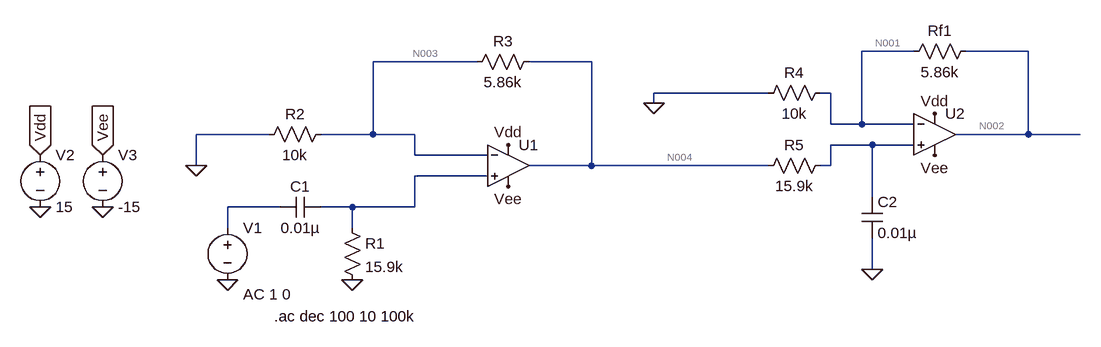
[diagram p0: schematic Active bandpass.asc]
Active bandpass.asc, the LTspice schematic file:
Version 4
SHEET 1 1520 680
WIRE 1024 224 944 224
WIRE 1200 224 1104 224
WIRE 352 240 192 240
WIRE 528 240 432 240
WIRE 800 288 624 288
WIRE 896 288 880 288
WIRE 624 304 624 288
WIRE 896 336 896 288
WIRE 944 336 944 224
WIRE 944 336 896 336
WIRE 1024 336 944 336
WIRE 32 352 -80 352
WIRE 192 352 192 240
WIRE 192 352 112 352
WIRE 256 352 192 352
WIRE 1200 352 1200 224
WIRE 1200 352 1088 352
WIRE 1280 352 1200 352
WIRE 960 368 896 368
WIRE 1024 368 960 368
WIRE 256 384 256 352
WIRE 368 384 256 384
WIRE -80 400 -80 352
WIRE 528 400 528 240
WIRE 528 400 432 400
WIRE 800 400 528 400
WIRE 896 400 896 368
WIRE 896 400 880 400
WIRE 368 416 256 416
WIRE 960 448 960 368
WIRE 48 464 -32 464
WIRE 160 464 112 464
WIRE 256 464 256 416
WIRE 256 464 160 464
WIRE -32 496 -32 464
WIRE 160 496 160 464
WIRE 960 560 960 512
FLAG -32 576 0
FLAG 160 576 0
FLAG -80 400 0
FLAG -320 384 Vdd
IOPIN -320 384 In
FLAG -224 384 Vee
IOPIN -224 384 In
FLAG -320 464 0
FLAG -224 464 0
FLAG 400 368 Vdd
FLAG 400 432 Vee
FLAG 1056 320 Vdd
FLAG 1056 384 Vee
FLAG 960 560 0
FLAG 624 304 0
SYMBOL Voltage -32 480 R0
WINDOW 123 24 118 Left 2
SYMATTR Value2 AC 1 0
SYMATTR InstName V1
SYMATTR Value ""
SYMBOL Voltage -320 368 R0
SYMATTR InstName V2
SYMATTR Value 15
SYMBOL Voltage -224 368 R0
SYMATTR InstName V3
SYMATTR Value -15
SYMBOL Res 144 480 R0
SYMATTR InstName R1
SYMATTR Value 15.9k
SYMBOL Cap 112 448 R90
WINDOW 0 0 32 VBottom 2
WINDOW 3 32 32 VTop 2
SYMATTR InstName C1
SYMATTR Value 0.01µ
SYMBOL Res 128 336 R90
WINDOW 0 0 56 VBottom 2
WINDOW 3 32 56 VTop 2
SYMATTR InstName R2
SYMATTR Value 10k
SYMBOL OpAmps/UniversalOpAmp 400 400 R0
SYMATTR InstName U1
SYMBOL Res 448 224 R90
WINDOW 0 0 56 VBottom 2
WINDOW 3 32 56 VTop 2
SYMATTR InstName R3
SYMATTR Value 5.86k
SYMBOL Res 896 272 R90
WINDOW 0 0 56 VBottom 2
WINDOW 3 32 56 VTop 2
SYMATTR InstName R4
SYMATTR Value 10k
SYMBOL Res 1120 208 R90
WINDOW 0 0 56 VBottom 2
WINDOW 3 32 56 VTop 2
SYMATTR InstName Rf1
SYMATTR Value 5.86k
SYMBOL Res 896 384 R90
WINDOW 0 0 56 VBottom 2
WINDOW 3 32 56 VTop 2
SYMATTR InstName R5
SYMATTR Value 15.9k
SYMBOL OpAmps/UniversalOpAmp 1056 352 R0
SYMATTR InstName U2
SYMBOL Cap 944 448 R0
SYMATTR InstName C2
SYMATTR Value 0.01µ
TEXT 40 632 Left 2 !.ac dec 100 10 100k

The netlist it stands for:
* Active bandpass.asc
V1 N007 0 AC 1 0
V2 Vdd 0 15
V3 Vee 0 -15
R1 N006 0 15.9k
C1 N006 N007 0.01µ
R2 N003 0 10k
XU1 N006 N003 Vdd Vee N004 level1 Avol=1Meg GBW=10Meg Vos=0 En=0 Enk=0 In=0 Ink=0 Rin=500Meg  ; pins In+ In- V+ V- OUT
R3 N004 N003 5.86k
R4 N001 0 10k
Rf1 N002 N001 5.86k
R5 N005 N004 15.9k
XU2 N005 N001 Vdd Vee N002 level1 Avol=1Meg GBW=10Meg Vos=0 En=0 Enk=0 In=0 Ink=0 Rin=500Meg  ; pins In+ In- V+ V- OUT
C2 N005 0 0.01µ
.ac dec 100 10 100k
.lib UniversalOpAmp1.lib
.backanno
.end

* Results of the author's LTspice run, read from the files saved beside the schematic
* Operating Point, zero values left out:
*   V(vdd) = 15 V
*   V(vee) = -15 V
*   I(V2) = -60 nA
*   I(V3) = 60 nA
*   Ix(u1:3) = 30 nA
*   Ix(u1:4) = -30 nA
*   Ix(u2:3) = 30 nA
*   Ix(u2:4) = -30 nA
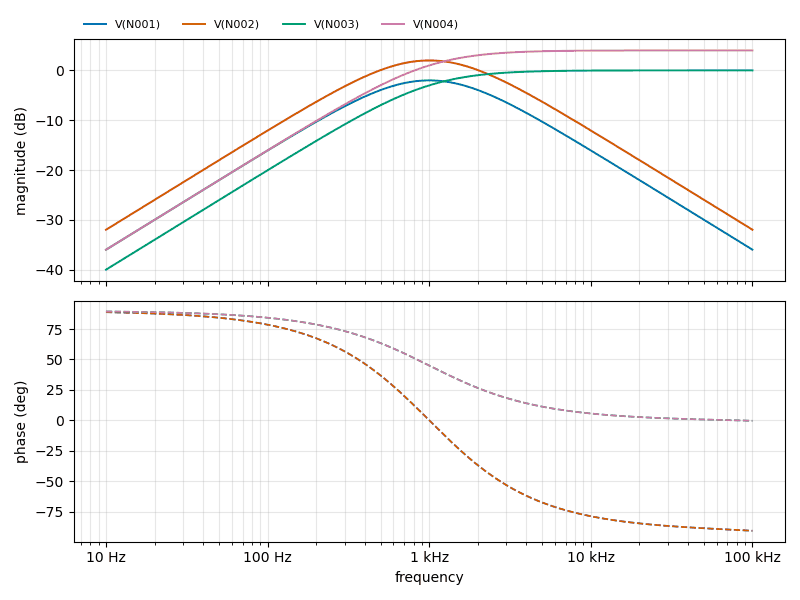
[diagram p1: AC Analysis of Active bandpass.asc, plotted from the saved traces]
* AC Analysis, 1 run:
*   V(N001): -36.00 dB at 10 Hz, -35.99 dB at 100 kHz, peak -2.01 dB at 1 kHz, 3 dB below the peak at 414.6 Hz and 2.417 kHz
*   V(N002): -32.00 dB at 10 Hz, -31.98 dB at 100 kHz, peak 1.99 dB at 1 kHz, 3 dB below the peak at 414.6 Hz and 2.417 kHz
*   V(N003): -40.01 dB at 10 Hz, -0.00 dB at 100 kHz, peak -0.00 dB at 79.43 kHz, 3 dB below the peak at 1.001 kHz
*   V(N004): -36.00 dB at 10 Hz, 4.00 dB at 100 kHz, peak 4.00 dB at 79.43 kHz, 3 dB below the peak at 1.001 kHz